# EAGLE schematic thermal_camera (EAGLE 9.6.2)
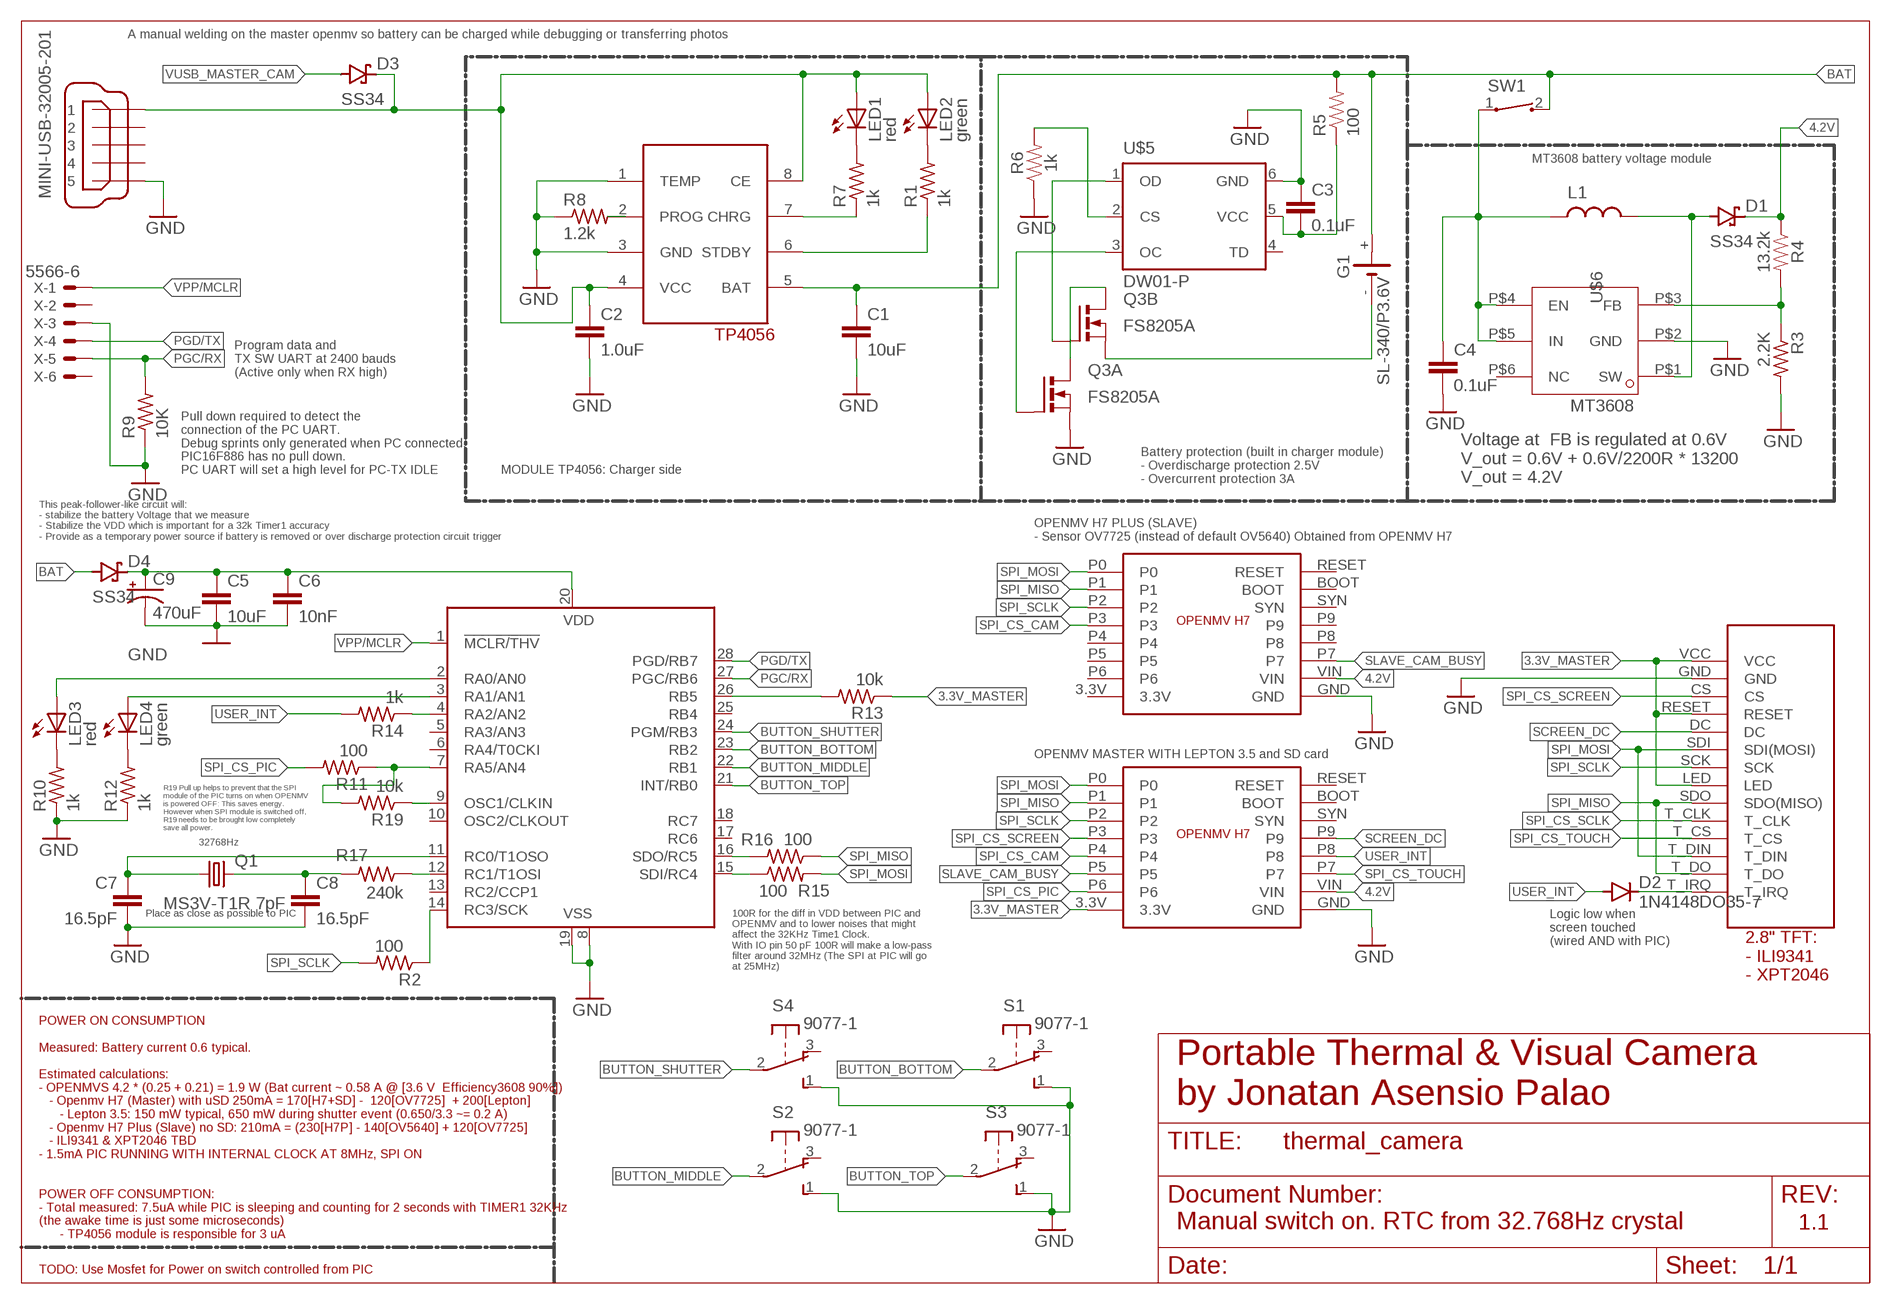
[diagram p0: schematic, sheet 1]

## Parts
C1  10uF  10UF-1206-6.3V-20%  [1206]
C2  1.0uF  1.0UF-0603-16V-10%  [0603]
C3  0.1uF  0.1UF-0603-25V-5%  [0603]
C4  0.1uF  0.1UF-0603-25V-5%  [0603]
C5  10uF  10UF-1206-6.3V-20%  [1206]
C6  10nF  10UF-1206-6.3V-20%  [1206]
C7  16.5pF  10UF-1206-6.3V-20%  [1206]
C8  16.5pF  10UF-1206-6.3V-20%  [1206]
C9  470uF  CPOL-US153CLV-0505  [153CLV-0505]
D1  SS34  DS_E2L  [E2LINE]
D2  1N4148DO35-7  [DO35-7]
D3  SS34  DS_E2L  [E2LINE]
D4  SS34  DS_E2L  [E2LINE]
G1  SL-340/P3.6V  [SL-340/P3.6V]
IC1  PIC16F876SO  [SO28W]
L1  L  (no package)
LED1  red  LEDCHIP-LED0805  [CHIP-LED0805]
LED2  green  LEDCHIP-LED0805  [CHIP-LED0805]
LED3  red  LEDCHIP-LED0805  [CHIP-LED0805]
LED4  green  LEDCHIP-LED0805  [CHIP-LED0805]
Q1  MS3V-T1R 7pF  FC-12M  [FC-12M]
Q3  FS8205A  DE275X2-102N06A  [DE_X]
R1  1k  R-US_0204/7  [0204/7]
R2  100  R-US_0204/7  [0204/7]
R3  2.2K  R-US_0204/7  [0204/7]
R4  13.2k  1KOHM-0603-1/10W-1%  [0603]
R5  100  RESISTOR0603-RES  [0603-RES]
R6  1k  1KOHM-0603-1/10W-1%  [0603]
R7  1k  R-US_0204/7  [0204/7]
R8  1.2k  R-US_0204/7  [0204/7]
R9  10K  R-US_0204/7  [0204/7]
R10  1k  R-US_0204/7  [0204/7]
R11  100  R-US_0204/7  [0204/7]
R12  1k  R-US_0204/7  [0204/7]
R13  10k  R-US_0204/7  [0204/7]
R14  1k  R-US_0204/7  [0204/7]
R15  100  R-US_0204/7  [0204/7]
R16  100  R-US_0204/7  [0204/7]
R17  240k  R-US_0204/7  [0204/7]
R19  10k  R-US_0204/7  [0204/7]
S1  9077-1  [9077-1]
S2  9077-1  [9077-1]
S3  9077-1  [9077-1]
S4  9077-1  [9077-1]
SW1  CT10-XXXX-A2  [CT10-XXXX-A2]
U$1  OPENMV_H7  [OPENMV_FOOTPRINT]
U$2  OPENMV_H7  [OPENMV_FOOTPRINT]
U$3  TP4056SO8  [SSOP08]
U$4  SCREEN_2_8_INCH  [SCREEN_2_8]
U$5  DW01-P  [SOT23-6L]
U$6  MT3608SOT23-6  [SOT23-6]
X  5566-6  [5566-6]
X1  MINI-USB-32005-201  [32005-201]

## Nets
3.3V_MASTER: R13.1 U$1.3.3V U$4.LED U$4.RESET U$4.VCC
4.2V: D1.1(K) R4.1 U$1.VIN U$2.VIN
BAT: C1.1 C5.1 C6.1 C9.+ D4.1(K) D4.2(A) G1.+ IC1.20(VDD) R5.2 SW1.2 U$3.5(BAT)
BUTTON_BOTTOM: IC1.23(RB2) S1.2(P)
BUTTON_MIDDLE: IC1.22(RB1) S2.2(P)
BUTTON_SHUTTER: IC1.24(PGM/RB3) S4.2(P)
BUTTON_TOP: IC1.21(INT/RB0) S3.2(P)
CHRG: R7.1 U$3.7(CHRG)
GND: C1.2 C2.2 C3.1 C4.2 C5.2 C6.2 C7.2 C8.2 C9.- IC1.8(VSS) IC1.19(VSS) Q3.SD1(A:SG1) Q3.SG1(A:SG1) R3.2 R6.1 R8.1 R9.1 R10.1 R12.1 S1.1(S) S2.1(S) S3.1(S) S4.1(S) U$1.GND U$2.GND U$3.1(TEMP) U$3.3(GND) U$4.GND U$5.6(GND) U$6.P$2(GND) X1.5 X.3
N$1: R6.2 U$5.2(CS)
N$2: Q3.G1(A:G) U$5.3(OC)
N$3: R8.2 U$3.2(PROG)
N$4: C2.1 D3.1(K) LED1.A LED2.A U$3.4(VCC) U$3.8(CE) X1.1
N$5: Q3.D1(A:D) Q3.D2(B:D)
N$6: LED2.C R1.2
N$7: G1.- Q3.SD2(B:SG1) Q3.SG2(B:SG1)
N$8: C4.1 L1.1 SW1.1 U$6.P$4(EN) U$6.P$5(IN)
N$9: R3.1 R4.2 U$6.P$3(FB)
N$10: D1.2(A) L1.2 U$6.P$1(SW)
N$11: R1.1 U$3.6(STDBY)
N$12: IC1.2(RA0/AN0) LED3.A
N$13: IC1.4(RA2/AN2) R14.1
N$14: IC1.14(RC3/SCK) R2.1
N$15: LED3.C R10.2
N$16: LED4.C R12.2
N$17: IC1.3(RA1/AN1) LED4.A
N$18: IC1.7(RA5/AN4) R11.1 R19.2
N$19: IC1.26(RB5) R13.2
N$20: LED1.C R7.2
N$21: IC1.9(OSC1/CLKIN) R19.1
N$24: IC1.12(RC1/T1OSI) R17.1
N$25: C7.1 IC1.11(RC0/T1OSO) Q1.1
N$26: C8.1 Q1.2 R17.2
N$39: D2.C U$4.T_IRQ
OD: Q3.G2(B:G) U$5.1(OD)
PGC/RX: IC1.27(PGC/RB6) R9.2 X.5
PGD/TX: IC1.28(PGD/RB7) X.4
SCREEN_DC: U$1.P9 U$4.DC
SLAVE_CAM_BUSY: U$1.P5 U$2.P7
SPI_CS_CAM: U$1.P4 U$2.P3
SPI_CS_PIC: R11.2 U$1.P6
SPI_CS_SCLK: U$4.T_CLK
SPI_CS_SCREEN: U$1.P3 U$4.CS
SPI_CS_TOUCH: U$1.P7 U$4.T_CS
SPI_MISO: IC1.16(SDO/RC5) R15.1 R15.2 U$1.P1 U$2.P1 U$4.SDO(SDO(MISO)) U$4.T_DO
SPI_MOSI: IC1.15(SDI/RC4) R16.1 R16.2 U$1.P0 U$2.P0 U$4.SDI(SDI(MOSI)) U$4.T_DIN
SPI_SCLK: R2.2 U$1.P2 U$2.P2 U$4.SCK
USER_INT: D2.A R14.2 U$1.P8
VCC-DW: C3.2 R5.1 U$5.5(VCC)
VPP/MCLR: IC1.1(!MCLR/THV) X.1
VUSB_MASTER_CAM: D3.2(A)
Unconnected: IC1.5(RA3/AN3) IC1.6(RA4/T0CKI) IC1.10(OSC2/CLKOUT) IC1.13(RC2/CCP1) IC1.17(RC6) IC1.18(RC7) IC1.25(RB4) S1.3(O) S2.3(O) S3.3(O) S4.3(O) U$1.BOOT U$1.RESET U$1.SYN U$2.3.3V U$2.BOOT U$2.P4 U$2.P5 U$2.P6 U$2.P8 U$2.P9 U$2.RESET U$2.SYN U$5.4(TD) U$6.P$6(NC) X1.2 X1.3 X1.4 X.2 X.6

## Notes on the sheet
- A manual welding on the master openmv so battery can be charged while debugging or transferring photos
- MT3608 battery voltage module
- Program data and
  TX SW UART at 2400 bauds
  (Active only when RX high)
- Pull down required to detect the
  connection of the PC UART.
  Debug sprints only generated when PC connected.
  PIC16F886 has no pull down.
  PC UART will set a high level for PC-TX IDLE
- MODULE TP4056: Charger side
- Battery protection (built in charger module)
  - Overdischarge protection 2.5V
  - Overcurrent protection 3A
- Voltage at  FB is regulated at 0.6V
  V_out = 0.6V + 0.6V/2200R * 13200
  V_out = 4.2V
- This peak-follower-like circuit will:
  - stabilize the battery Voltage that we measure
  - Stabilize the VDD which is important for a 32k Timer1 accuracy
  - Provide as a temporary power source if battery is removed or over discharge protection circuit trigger
- OPENMV H7 PLUS (SLAVE) 
  - Sensor OV7725 (instead of default OV5640) Obtained from OPENMV H7
- OPENMV MASTER WITH LEPTON 3.5 and SD card
- R19 Pull up helps to prevent that the SPI 
  module of the PIC turns on when OPENMV
  is powered OFF: This saves energy.
  However when SPI module is switched off,
  R19 needs to be brought low completely 
  save all power.
- 32768Hz
- Place as close as possible to PIC
- 100R for the diff in VDD between PIC and
  OPENMV and to lower noises that might 
  affect the 32KHz Time1 Clock.
  With IO pin 50 pF 100R will make a low-pass
  filter around 32MHz (The SPI at PIC will go
  at 25MHz)
- Logic low when 
  screen touched
  (wired AND with PIC)
- POWER ON CONSUMPTION
  
  Measured: Battery current 0.6 typical.
  
  Estimated calculations:
  - OPENMVS 4.2 * (0.25 + 0.21) = 1.9 W (Bat current ~ 0.58 A @ [3.6 V  Efficiency3608 90%])
     - Openmv H7 (Master) with uSD 250mA = 170[H7+SD] -  120[OV7725]  + 200[Lepton]
        - Lepton 3.5: 150 mW typical, 650 mW during shutter event (0.650/3.3 ~= 0.2 A)
     - Openmv H7 Plus (Slave) no SD: 210mA = (230[H7P] - 140[OV5640] + 120[OV7725] 
     - ILI9341 & XPT2046 TBD
  - 1.5mA PIC RUNNING WITH INTERNAL CLOCK AT 8MHz, SPI ON
  
  
  POWER OFF CONSUMPTION:
  - Total measured: 7.5uA while PIC is sleeping and counting for 2 seconds with TIMER1 32KHz
  (the awake time is just some microseconds)
        - TP4056 module is responsible for 3 uA
- Portable Thermal & Visual Camera
  by Jonatan Asensio Palao
- Manual switch on. RTC from 32.768Hz crystal | 1.1
- TODO: Use Mosfet for Power on switch controlled from PIC

## Library data of the parts
C1 C5 = SparkFun-Capacitors:10UF: 10.0�F ceramic capacitors A capacitor is a passive two-terminal electrical component used to store electrical energy temporarily in an electric field.; PROD_ID: CAP-10057
C2 = SparkFun-Capacitors:1.0UF: 1�F ceramic capacitors A capacitor is a passive two-terminal electrical component used to store electrical energy temporarily in an electric field.; PROD_ID: CAP-00868
C3 C4 = SparkFun-Capacitors:0.1UF: 0.1�F ceramic capacitors A capacitor is a passive two-terminal electrical component used to store electrical energy temporarily in an electric field.; PROD_ID: CAP-08604
C6-C8 = SparkFun-Capacitors:10UF: 10.0�F ceramic capacitors A capacitor is a passive two-terminal electrical component used to store electrical energy temporarily in an electric field.; PROD_ID: CAP-10057; VALUE: 10uF
C9 = rcl:CPOL-US: POLARIZED CAPACITOR, American symbol; SPICEPREFIX: C
D1 D3 D4 = zetex:DS_E2L: SHOTTKY DIODE; OC_FARNELL: unknown; OC_NEWARK: unknown
D2 = diode:1N4148: DIODE high speed (Philips)
G1 = battery:SL-340/P3.6V: LI BATTERY Sonnenschein
IC1 = microchip:PIC16*876: MICROCONTROLLER flash type; MF: MICROCHIP; MPN: PIC16F876-20/SO; OC_FARNELL: 9761268; OC_NEWARK: 12C1950
L1 = ngspice-simulation:L: INDUCTOR
LED1-LED4 = adafruit:LED: LED OSRAM: - CHIPLED LG R971, LG N971, LY N971, LG Q971, LY Q971, LO R971, LY R971 LH N974, LH R974 LS Q976, LO Q976, LY Q976 LO Q996 - Hyper CHIPLED LW Q18S LB Q993, LB Q99A, LB R99A - SideLED LS A670, LO A670, LY A670, LG A670, LP A670 LB A673, LV A673, LT A673, LW A673 LH A674 LY A675 LS A676, LA A676, LO A676, LY A676, LW A676 LS A679, LY A679, LG A679 - Hyper Micro SIDELED® LS Y876, LA Y876, LO Y876, LY Y876 LT Y87S - SmartLED LW L88C, LW L88S LB L89C, LB L89S, LG L890 LS L89K, LO L89K, LY L89K LS L896, LA L896, LO L896, LY L896 - TOPLED LS T670, LO T670, LY T670, LG T670, LP T670 LSG T670, LSP T670, LSY T670, LOP T670, LYG T670 LG T671, LOG T671, LSG T671 LB T673, LV T673, LT T673, LW T673 LH T674 LS T676, LA T676, LO T676, LY T676, LB T676, LH T676, LSB T676, LW T676 LB T67C, LV T67C, LT T67C, LS T67K, LO T67K, LY T67K, LW E67C LS E67B, LA E67B, LO E67B, LY E67B, LB E67C, LV E67C, LT E67C LW T67C LS T679, LY T679, LG T679 LS T770, LO T770, LY T770, LG T770, LP T770 LB T773, LV T773, LT T773, LW T773 LH T774 LS E675, LA E675, LY E675, LS T675 LS T776, LA T776, LO T776, LY T776, LB T776 LHGB T686 LT T68C, LB T68C - Hyper Mini TOPLED® LB M676 - Mini TOPLED Santana® LG M470 LS M47K, LO M47K, LY M47K Source: http://www.osram.convergy.de/
Q1 = crystal:FC-12M: kHz RANGE CRYSTAL UNIT LOW PROFILE SMD Source: Epson Toyocom FC-12M.pdf
Q3 = transistor-power:DE?X*: RF Power MOSFET Common Source Push-Pull Pair N-Channel Enhancement Mode Source: Data sheet <http://ixysrf.com/pdf/switch_mode/de275x2_501n16a.pdf>; SPICEPREFIX: Q
R1-R3 R7-R17 R19 = rcl:R-US_: RESISTOR, American symbol; SPICEPREFIX: R
R4 = SparkFun-Resistors:1KOHM: 1kO resistor A resistor is a passive two-terminal electrical component that implements electrical resistance as a circuit element. Resistors act to reduce current flow, and, at the same time, act to lower voltage levels within circuits. - Wikipedia; PROD_ID: RES-07856; VALUE: 1k
R5 = SparkFun:RESISTOR: Resistor Basic schematic elements and footprints for 0603, 1206, and PTH resistors.
R6 = SparkFun-Resistors:1KOHM: 1kO resistor A resistor is a passive two-terminal electrical component that implements electrical resistance as a circuit element. Resistors act to reduce current flow, and, at the same time, act to lower voltage levels within circuits. - Wikipedia; PROD_ID: RES-07856
S1-S4 = switch-misc:9077-1: MARQUARDT SWITCH 9077.0100 Distributor: Buerklin <https://www.buerklin.com/default.asp?event=ShowArtikel%2812G2820%29&l=d&jump=ArtNr_12G2820>
SW1 = switch-coto:CT10-XXXX-: CT10 Series Molded Switch Source: www.cotorelay.com .. Coto_Technology__CT10-1530-G1.pdf
U$1 U$2 = components:OPENMV_H7
U$3 = components:TP4056
U$4 = components:SCREEN_2_8_INCH
U$5 = lipo:DW01-P: One Cell Lithium-ion/Polymer Battery Protection IC The DW01-P battery protection IC is designed to protect lithium-ion/polymer battery from damage or degrading the lifetime due to overcharge, overdischarge, and/or overcurrent for one-cell lithium-ion/polymer battery powered systems, such as cellular phones. The ultra-small package and less required external components make it ideal to integrate the DW01-P into the limited space of battery pack. The accurate �50mV overcharging detection voltage ensures safe and full utilization charging. The very low standby current drains little current from the cell while in storage.
U$6 = MT3608:MT3608: MT3608 High Efficiency 1.2MHz 2A Step Up Converter BY: Rangana Tennakoon
X = con-molex:5566-6: Mini FIT connector 6 pol Source: http://www.molex.com; MF: MOLEX; MPN: 95566-61002; OC_FARNELL: unknown; OC_NEWARK: 22K8620
X1 = con-cypressindustries:MINI-USB-: MINI USB-B Conector Source: www.cypressindustries.com; OC_FARNELL: unknown; OC_NEWARK: unknown